# Altium schematic sheet PWM-Generator.SchDoc
size A4
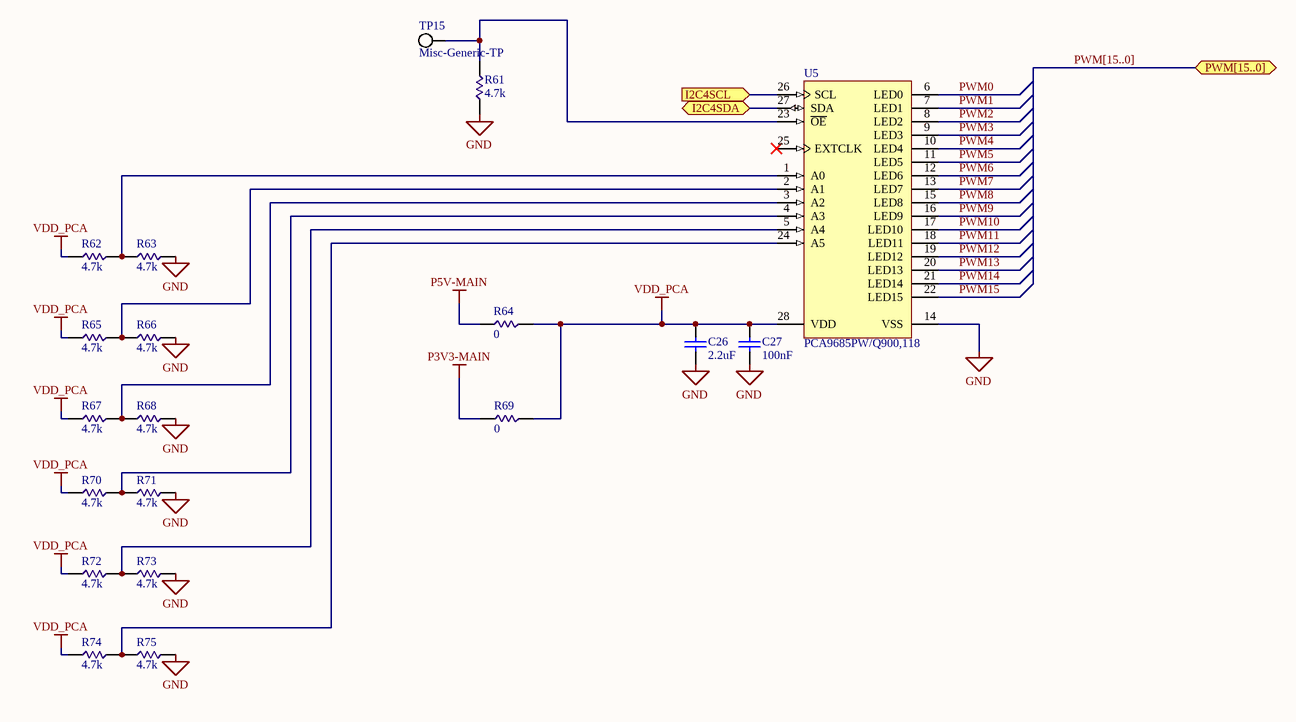
[diagram p0: PWM-Generator.SchDoc]

## Parts
C26  value 2.2uF  [FOOTPRINT-0805-GEN]  (hidden comment: C0805C225K8RACTU)
C27  value 100nF  [FOOTPRINT-0805-GEN]  (hidden comment: C0805C104K8RACTU)
R61  value 4.7k  [FOOTPRINT-0805-GEN]  (hidden comment: SMC)
R62  value 4.7k  [FOOTPRINT-0805-GEN]  (hidden comment: SMC)
R63  value 4.7k  [FOOTPRINT-0805-GEN]  (hidden comment: SMC)
R64  value 0  [FOOTPRINT-0805-GEN]  (hidden comment: SMC)
R65  value 4.7k  [FOOTPRINT-0805-GEN]  (hidden comment: SMC)
R66  value 4.7k  [FOOTPRINT-0805-GEN]  (hidden comment: SMC)
R67  value 4.7k  [FOOTPRINT-0805-GEN]  (hidden comment: SMC)
R68  value 4.7k  [FOOTPRINT-0805-GEN]  (hidden comment: SMC)
R69  value 0  [FOOTPRINT-0805-GEN]  (hidden comment: SMC)
R70  value 4.7k  [FOOTPRINT-0805-GEN]  (hidden comment: SMC)
R71  value 4.7k  [FOOTPRINT-0805-GEN]  (hidden comment: SMC)
R72  value 4.7k  [FOOTPRINT-0805-GEN]  (hidden comment: SMC)
R73  value 4.7k  [FOOTPRINT-0805-GEN]  (hidden comment: SMC)
R74  value 4.7k  [FOOTPRINT-0805-GEN]  (hidden comment: SMC)
R75  value 4.7k  [FOOTPRINT-0805-GEN]  (hidden comment: SMC)
TP15  Misc-Generic-TP  [FOOTPRINT-GENERIC-TP-VIA-1MM]
U5  PCA9685PW/Q900,118  [FOOTPRINT-NXP-PCA9685]

## Ports
I2C4SCL (in), I2C4SDA (bidir), PWM[15..0] (bidir)

## Nets
GND: C26.2 C27.1 R61.1 R63.2 R66.2 R68.2 R71.2 R73.2 R75.2 U5.14(VSS)
P3V3-MAIN: R69.1
P5V-MAIN: R64.2
VDD_PCA: C26.1 C27.2 R62.2 R64.1 R65.2 R67.2 R69.2 R70.2 R72.2 R74.2 U5.28(VDD)
I2C4SCL: U5.26(SCL) ; port I2C4SCL
I2C4SDA: U5.27(SDA) ; port I2C4SDA
PWM0: U5.6(LED0)
PWM1: U5.7(LED1)
PWM2: U5.8(LED2)
PWM3: U5.9(LED3)
PWM4: U5.10(LED4)
PWM5: U5.11(LED5)
PWM6: U5.12(LED6)
PWM7: U5.13(LED7)
PWM8: U5.15(LED8)
PWM9: U5.16(LED9)
PWM10: U5.17(LED10)
PWM11: U5.18(LED11)
PWM12: U5.19(LED12)
PWM13: U5.20(LED13)
PWM14: U5.21(LED14)
PWM15: U5.22(LED15)
NetR61_2: R61.2 TP15.1(TP) U5.23(~{OE})
NetR62_1: R62.1 R63.1 U5.1(A0)
NetR65_1: R65.1 R66.1 U5.2(A1)
NetR67_1: R67.1 R68.1 U5.3(A2)
NetR70_1: R70.1 R71.1 U5.4(A3)
NetR72_1: R72.1 R73.1 U5.5(A4)
NetR74_1: R74.1 R75.1 U5.24(A5)

Not connected (* = marked no-connect by the designer): U5 25(EXTCLK)*

## Buses and harness runs
bus PWM[15..0] = port PWM[15..0]

## Notes on the sheet
- Title
- Size:
- Date:
- Engineer
- A4
- Number:
- Sheet
- of
- Approved
- Revision:
- UC Riverside
- www.highlanderracing.org <https://www.highlanderracing.org>
- File:

## Library data of the parts
C26 C27 = Capacitor-Generic-0805: Capacitor; Published: 8-Jun-2000; LatestRevisionDate: 17-Jul-2002; LatestRevisionNote: Re-released for DXP Platform.; PackageReference: RAD-0.3; Publisher: Altium Limited; PackageDescription: Radial Cap, Thru-Hole; 2 Leads; 0.3 in Pin Spacing
R61-R75 = Resistor-Generic-0805-2012: 1/8 Watt Surface Mount Resistor
U5 = IC-NXP-PCA9685: 16-Channel, 12-Bit PWM Fm+ I2C-Bus LED Controller, 2.3 to 5.5 V, -40 to 85 degC, 28-Pin TSSOP (SOT361-1), RoHS, Tape and Reel; Supply Voltage Max: 5.5 V; Supply Current Max: 10 mA; Supply Voltage Min: 2.3 V; Frequency: 25000000 Hz; ComponentLink1Description: Manufacturer URL; PackageVersion: 02/2003; PackageDescription: 28-Pin Small Outline Package, Body 9.7 x 4.4 mm, Pitch 0.65 mm; Packing: Tape and Reel; ComponentLink2URL: http://www.nxp.com/documents/data_sheet/PCA9685.pdf; ComponentLink1URL: http://www.nxp.com/; Mounting Technology: Surface Mount; PartNumber: PCA9685; ComponentLink2Description: Datasheet; Temperature Min: -40 degC; ComponentLink3URL: http://www.nxp.com/documents/outline_drawing/sot361-1_po.pdf; Temperature Max: 85 degC; DatasheetVersion: Rev. 4; ComponentLink3Description: Package Specification; RoHS: TRUE; Code_JEDEC: MO-153